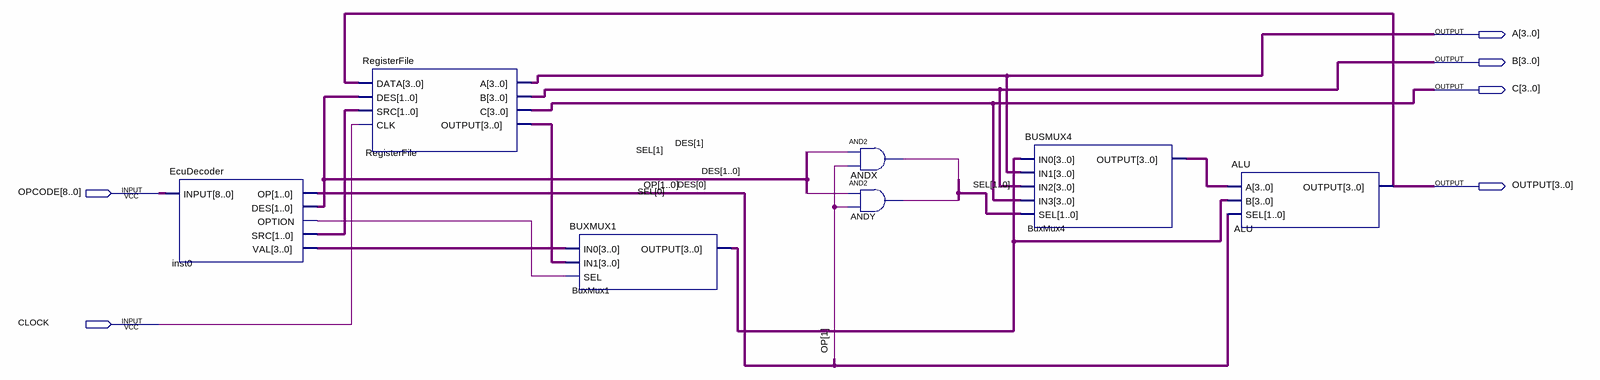
[diagram p0: schematic sheet]
// Quartus schematic ECU.bdf as structural Verilog: 7 symbols, 6 pins
module ECU (
  input  [8:0] OPCODE,
  input  CLOCK,
  output [3:0] A,
  output [3:0] B,
  output [3:0] C,
  output [3:0] OUTPUT
);

  wire inst0_option;
  wire [1:0] DES, inst0_src, OP, SEL;
  wire [3:0] BuxMux1_output, BuxMux4_output, inst0_val, RegisterFile_output;

  EcuDecoder inst0 (.INPUT(OPCODE), .OP(OP), .DES(DES), .OPTION(inst0_option), .SRC(inst0_src), .VAL(inst0_val));
  RegisterFile RegisterFile (
    .DATA(OUTPUT), .DES(DES), .SRC(inst0_src), .CLK(CLOCK), .A(A), .B(B), .C(C), .OUTPUT(RegisterFile_output));
  BUXMUX1 BuxMux1 (.IN0(inst0_val), .IN1(RegisterFile_output), .SEL(inst0_option), .OUTPUT(BuxMux1_output));
  and ANDX (SEL[1], DES[1], OP[1]);
  and ANDY (SEL[0], DES[0], OP[1]);
  BUSMUX4 BuxMux4 (.IN0(BuxMux1_output), .IN1(A), .IN2(B), .IN3(C), .SEL(SEL), .OUTPUT(BuxMux4_output));
  ALU ALU (.A(BuxMux4_output), .B(BuxMux1_output), .SEL(OP), .OUTPUT(OUTPUT));
endmodule
